# Altium schematic sheet spider-som.SchDoc
size A3
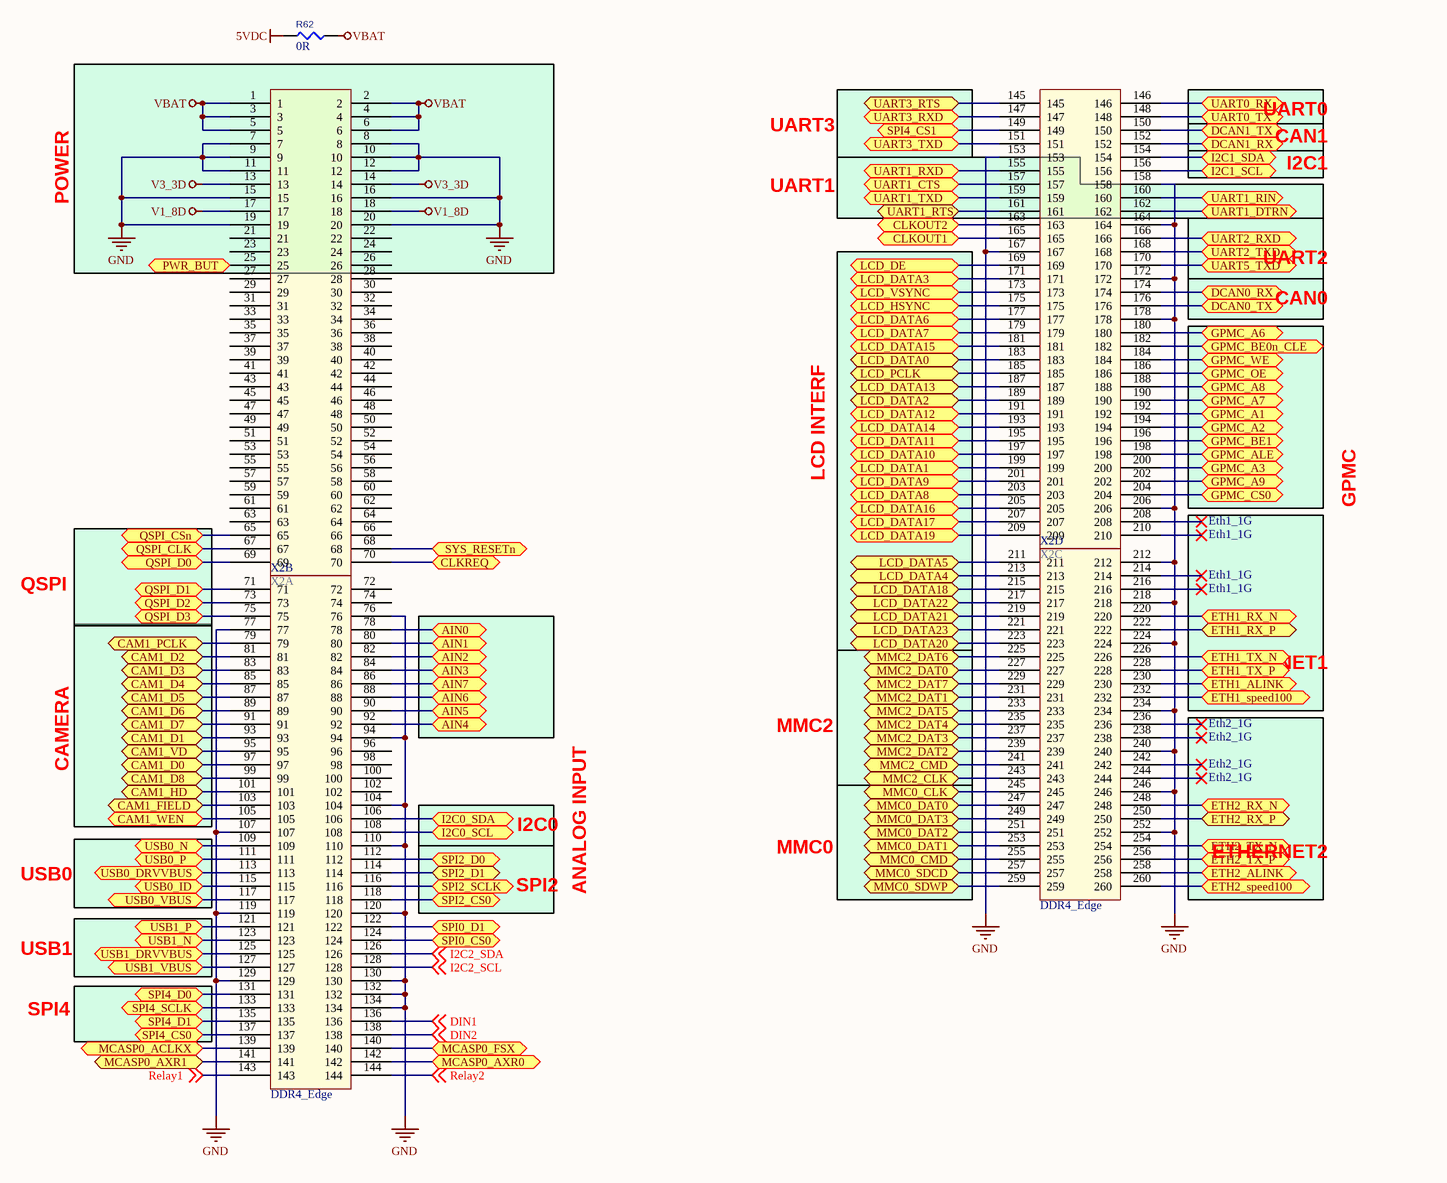
[diagram p0: spider-som.SchDoc]

## Parts
R62  value 0R  [RESC1608X55N]  (hidden comment: R0603)
X2  DDR4_Edge  [DDR4 SO_DIMM connector]  (value not drawn)  (parts A,B,C,D of 4)

## Ports
AIN0, AIN1, AIN2, AIN3, AIN4, AIN5, AIN6, AIN7, CAM1_D0, CAM1_D1, CAM1_D2, CAM1_D3, CAM1_D4, CAM1_D5, CAM1_D6, CAM1_D7, CAM1_D8, CAM1_FIELD, CAM1_HD, CAM1_PCLK, CAM1_VD, CAM1_WEN, CLKOUT1, CLKOUT2, CLKREQ, DCAN0_RX, DCAN0_TX, DCAN1_RX, DCAN1_TX, ETH1_ALINK, ETH1_RX_N, ETH1_RX_P, ETH1_speed100, ETH1_TX_N, ETH1_TX_P, ETH2_ALINK, ETH2_RX_N, ETH2_RX_P, ETH2_speed100, ETH2_TX_N, ETH2_TX_P, GPMC_A1, GPMC_A2, GPMC_A3, GPMC_A6, GPMC_A7, GPMC_A8, GPMC_A9, GPMC_ALE, GPMC_BE0n_CLE, GPMC_BE1, GPMC_CS0, GPMC_OE, GPMC_WE, I2C0_SCL, I2C0_SDA, I2C1_SCL, I2C1_SDA, LCD_DATA0, LCD_DATA1, LCD_DATA2, LCD_DATA3, LCD_DATA4, LCD_DATA5, LCD_DATA6, LCD_DATA7, LCD_DATA8, LCD_DATA9, LCD_DATA10, LCD_DATA11, LCD_DATA12, LCD_DATA13, LCD_DATA14, LCD_DATA15, LCD_DATA16, LCD_DATA17, LCD_DATA18, LCD_DATA19, LCD_DATA20, LCD_DATA21, LCD_DATA22, LCD_DATA23, LCD_DE, LCD_HSYNC, LCD_PCLK, LCD_VSYNC, MCASP0_ACLKX, MCASP0_AXR0, MCASP0_AXR1, MCASP0_FSX, MMC0_CLK, MMC0_CMD, MMC0_DAT0, MMC0_DAT1, MMC0_DAT2, MMC0_DAT3, MMC0_SDCD, MMC0_SDWP, MMC2_CLK, MMC2_CMD, MMC2_DAT0, MMC2_DAT1, MMC2_DAT2, MMC2_DAT3, MMC2_DAT4, MMC2_DAT5, MMC2_DAT6, MMC2_DAT7, PWR_BUT, QSPI_CLK, QSPI_CSn, QSPI_D0, QSPI_D1, QSPI_D2, QSPI_D3, SPI0_CS0, SPI0_D1, SPI2_CS0, SPI2_D0, SPI2_D1, SPI2_SCLK, SPI4_CS0, SPI4_CS1, SPI4_D0, SPI4_D1, SPI4_SCLK, SYS_RESETn, UART0_RX, UART0_TX, UART1_CTS, UART1_DTRN, UART1_RIN, UART1_RTS, UART1_RXD, UART1_TXD, UART2_RXD, UART2_TXD, UART3_RTS, UART3_RXD, UART3_TXD, UART5_TXD, USB0_DRVVBUS, USB0_ID, USB0_N, USB0_P, USB0_VBUS, USB1_DRVVBUS, USB1_N, USB1_P, USB1_VBUS

## Nets
5VDC: R62.1
GND: X2.7 X2.8 X2.9 X2.10 X2.11 X2.12 X2.15 X2.16 X2.19 X2.20 X2.76 X2.77 X2.94 X2.104 X2.107 X2.110 X2.119 X2.120 X2.129 X2.130 X2.132 X2.134 X2.153 X2.158 X2.164 X2.167 X2.172 X2.178 X2.206 X2.212 X2.218 X2.224 X2.234 X2.240 X2.246 X2.252
V1_8D: X2.17 X2.18
V3_3D: X2.13 X2.14
VBAT: R62.2 X2.1 X2.2 X2.3 X2.4 X2.5 X2.6
AIN0: X2.78 ; port AIN0
AIN1: X2.80 ; port AIN1
AIN2: X2.82 ; port AIN2
AIN3: X2.84 ; port AIN3
AIN4: X2.92 ; port AIN4
AIN5: X2.90 ; port AIN5
AIN6: X2.88 ; port AIN6
AIN7: X2.86 ; port AIN7
CAM1_D0: X2.97 ; port CAM1_D0
CAM1_D1: X2.93 ; port CAM1_D1
CAM1_D2: X2.81 ; port CAM1_D2
CAM1_D3: X2.83 ; port CAM1_D3
CAM1_D4: X2.85 ; port CAM1_D4
CAM1_D5: X2.87 ; port CAM1_D5
CAM1_D6: X2.89 ; port CAM1_D6
CAM1_D7: X2.91 ; port CAM1_D7
CAM1_D8: X2.99 ; port CAM1_D8
CAM1_FIELD: X2.103 ; port CAM1_FIELD
CAM1_HD: X2.101 ; port CAM1_HD
CAM1_PCLK: X2.79 ; port CAM1_PCLK
CAM1_VD: X2.95 ; port CAM1_VD
CAM1_WEN: X2.105 ; port CAM1_WEN
CLKOUT1: X2.165 ; port CLKOUT1
CLKOUT2: X2.163 ; port CLKOUT2
CLKREQ: X2.70 ; port CLKREQ
DCAN0_RX: X2.174 ; port DCAN0_RX
DCAN0_TX: X2.176 ; port DCAN0_TX
DCAN1_RX: X2.152 ; port DCAN1_RX
DCAN1_TX: X2.150 ; port DCAN1_TX
DIN1: X2.136 ; off-sheet DIN1
DIN2: X2.138 ; off-sheet DIN2
ETH1_ALINK: X2.230 ; port ETH1_ALINK
ETH1_RX_N: X2.220 ; port ETH1_RX_N
ETH1_RX_P: X2.222 ; port ETH1_RX_P
ETH1_speed100: X2.232 ; port ETH1_speed100
ETH1_TX_N: X2.226 ; port ETH1_TX_N
ETH1_TX_P: X2.228 ; port ETH1_TX_P
ETH2_ALINK: X2.258 ; port ETH2_ALINK
ETH2_RX_N: X2.248 ; port ETH2_RX_N
ETH2_RX_P: X2.250 ; port ETH2_RX_P
ETH2_speed100: X2.260 ; port ETH2_speed100
ETH2_TX_N: X2.254 ; port ETH2_TX_N
ETH2_TX_P: X2.256 ; port ETH2_TX_P
GPMC_A1: X2.192 ; port GPMC_A1
GPMC_A2: X2.194 ; port GPMC_A2
GPMC_A3: X2.200 ; port GPMC_A3
GPMC_A6: X2.180 ; port GPMC_A6
GPMC_A7: X2.190 ; port GPMC_A7
GPMC_A8: X2.188 ; port GPMC_A8
GPMC_A9: X2.202 ; port GPMC_A9
GPMC_ALE: X2.198 ; port GPMC_ALE
GPMC_BE0n_CLE: X2.182 ; port GPMC_BE0n_CLE
GPMC_BE1: X2.196 ; port GPMC_BE1
GPMC_CS0: X2.204 ; port GPMC_CS0
GPMC_OE: X2.186 ; port GPMC_OE
GPMC_WE: X2.184 ; port GPMC_WE
I2C0_SCL: X2.108 ; port I2C0_SCL
I2C0_SDA: X2.106 ; port I2C0_SDA
I2C1_SCL: X2.156 ; port I2C1_SCL
I2C1_SDA: X2.154 ; port I2C1_SDA
I2C2_SCL: X2.128 ; off-sheet I2C2_SCL
I2C2_SDA: X2.126 ; off-sheet I2C2_SDA
LCD_DATA0: X2.183 ; port LCD_DATA0
LCD_DATA1: X2.199 ; port LCD_DATA1
LCD_DATA2: X2.189 ; port LCD_DATA2
LCD_DATA3: X2.171 ; port LCD_DATA3
LCD_DATA4: X2.213 ; port LCD_DATA4
LCD_DATA5: X2.211 ; port LCD_DATA5
LCD_DATA6: X2.177 ; port LCD_DATA6
LCD_DATA7: X2.179 ; port LCD_DATA7
LCD_DATA8: X2.203 ; port LCD_DATA8
LCD_DATA9: X2.201 ; port LCD_DATA9
LCD_DATA10: X2.197 ; port LCD_DATA10
LCD_DATA11: X2.195 ; port LCD_DATA11
LCD_DATA12: X2.191 ; port LCD_DATA12
LCD_DATA13: X2.187 ; port LCD_DATA13
LCD_DATA14: X2.193 ; port LCD_DATA14
LCD_DATA15: X2.181 ; port LCD_DATA15
LCD_DATA16: X2.205 ; port LCD_DATA16
LCD_DATA17: X2.207 ; port LCD_DATA17
LCD_DATA18: X2.215 ; port LCD_DATA18
LCD_DATA19: X2.209 ; port LCD_DATA19
LCD_DATA20: X2.223 ; port LCD_DATA20
LCD_DATA21: X2.219 ; port LCD_DATA21
LCD_DATA22: X2.217 ; port LCD_DATA22
LCD_DATA23: X2.221 ; port LCD_DATA23
LCD_DE: X2.169 ; port LCD_DE
LCD_HSYNC: X2.175 ; port LCD_HSYNC
LCD_PCLK: X2.185 ; port LCD_PCLK
LCD_VSYNC: X2.173 ; port LCD_VSYNC
MCASP0_ACLKX: X2.139 ; port MCASP0_ACLKX
MCASP0_AXR0: X2.142 ; port MCASP0_AXR0
MCASP0_AXR1: X2.141 ; port MCASP0_AXR1
MCASP0_FSX: X2.140 ; port MCASP0_FSX
MMC0_CLK: X2.245 ; port MMC0_CLK
MMC0_CMD: X2.255 ; port MMC0_CMD
MMC0_DAT0: X2.247 ; port MMC0_DAT0
MMC0_DAT1: X2.253 ; port MMC0_DAT1
MMC0_DAT2: X2.251 ; port MMC0_DAT2
MMC0_DAT3: X2.249 ; port MMC0_DAT3
MMC0_SDCD: X2.257 ; port MMC0_SDCD
MMC0_SDWP: X2.259 ; port MMC0_SDWP
MMC2_CLK: X2.243 ; port MMC2_CLK
MMC2_CMD: X2.241 ; port MMC2_CMD
MMC2_DAT0: X2.227 ; port MMC2_DAT0
MMC2_DAT1: X2.231 ; port MMC2_DAT1
MMC2_DAT2: X2.239 ; port MMC2_DAT2
MMC2_DAT3: X2.237 ; port MMC2_DAT3
MMC2_DAT4: X2.235 ; port MMC2_DAT4
MMC2_DAT5: X2.233 ; port MMC2_DAT5
MMC2_DAT6: X2.225 ; port MMC2_DAT6
MMC2_DAT7: X2.229 ; port MMC2_DAT7
PWR_BUT: X2.25 ; port PWR_BUT
QSPI_CLK: X2.67 ; port QSPI_CLK
QSPI_CSn: X2.65 ; port QSPI_CSn
QSPI_D0: X2.69 ; port QSPI_D0
QSPI_D1: X2.71 ; port QSPI_D1
QSPI_D2: X2.73 ; port QSPI_D2
QSPI_D3: X2.75 ; port QSPI_D3
Relay1: X2.143 ; off-sheet Relay1
Relay2: X2.144 ; off-sheet Relay2
SPI0_CS0: X2.124 ; port SPI0_CS0
SPI0_D1: X2.122 ; port SPI0_D1
SPI2_CS0: X2.118 ; port SPI2_CS0
SPI2_D0: X2.112 ; port SPI2_D0
SPI2_D1: X2.114 ; port SPI2_D1
SPI2_SCLK: X2.116 ; port SPI2_SCLK
SPI4_CS0: X2.137 ; port SPI4_CS0
SPI4_CS1: X2.149 ; port SPI4_CS1
SPI4_D0: X2.131 ; port SPI4_D0
SPI4_D1: X2.135 ; port SPI4_D1
SPI4_SCLK: X2.133 ; port SPI4_SCLK
SYS_RESETn: X2.68 ; port SYS_RESETn
UART0_RX: X2.146 ; port UART0_RX
UART0_TX: X2.148 ; port UART0_TX
UART1_CTS: X2.157 ; port UART1_CTS
UART1_DTRN: X2.162 ; port UART1_DTRN
UART1_RIN: X2.160 ; port UART1_RIN
UART1_RTS: X2.161 ; port UART1_RTS
UART1_RXD: X2.155 ; port UART1_RXD
UART1_TXD: X2.159 ; port UART1_TXD
UART2_RXD: X2.166 ; port UART2_RXD
UART2_TXD: X2.168 ; port UART2_TXD
UART3_RTS: X2.145 ; port UART3_RTS
UART3_RXD: X2.147 ; port UART3_RXD
UART3_TXD: X2.151 ; port UART3_TXD
UART5_TXD: X2.170 ; port UART5_TXD
USB0_DRVVBUS: X2.113 ; port USB0_DRVVBUS
USB0_ID: X2.115 ; port USB0_ID
USB0_N: X2.109 ; port USB0_N
USB0_P: X2.111 ; port USB0_P
USB0_VBUS: X2.117 ; port USB0_VBUS
USB1_DRVVBUS: X2.125 ; port USB1_DRVVBUS
USB1_N: X2.123 ; port USB1_N
USB1_P: X2.121 ; port USB1_P
USB1_VBUS: X2.127 ; port USB1_VBUS

Not connected (* = marked no-connect by the designer): X2 21 22 23 24 26 27 28 29 30 31 32 33 34 35 36 37 38 39 40 41 42 43 44 45 46 47 48 49 50 51 52 53 54 55 56 57 58 59 60 61 62 63 64 66 72 74 96 98 100 102 208* 210* 214* 216* 236* 238* 242* 244*

## Notes on the sheet
- UART0
- CAN1
- POWER
- UART3
- UART1
- I2C1
- UART2
- CAN0
- GPMC
- LCD INTERF
- Eth1_1G
- QSPI
- ETHERNET1
- ANALOG INPUT
- MMC2
- Eth2_1G
- CAMERA
- I2C0
- SPI2
- MMC0
- ETHERNET2
- USB0
- USB1
- SPI4

## Library data of the parts
X2 = DDR4_Edge: DDR4 edge memory SO-DIMM connector, 260 pin; P/N: 2309407-1
R62 = R0603: P/N: *